# EAGLE design Atmega328p_sismin_attempt 4 (EAGLE 9.6.2)
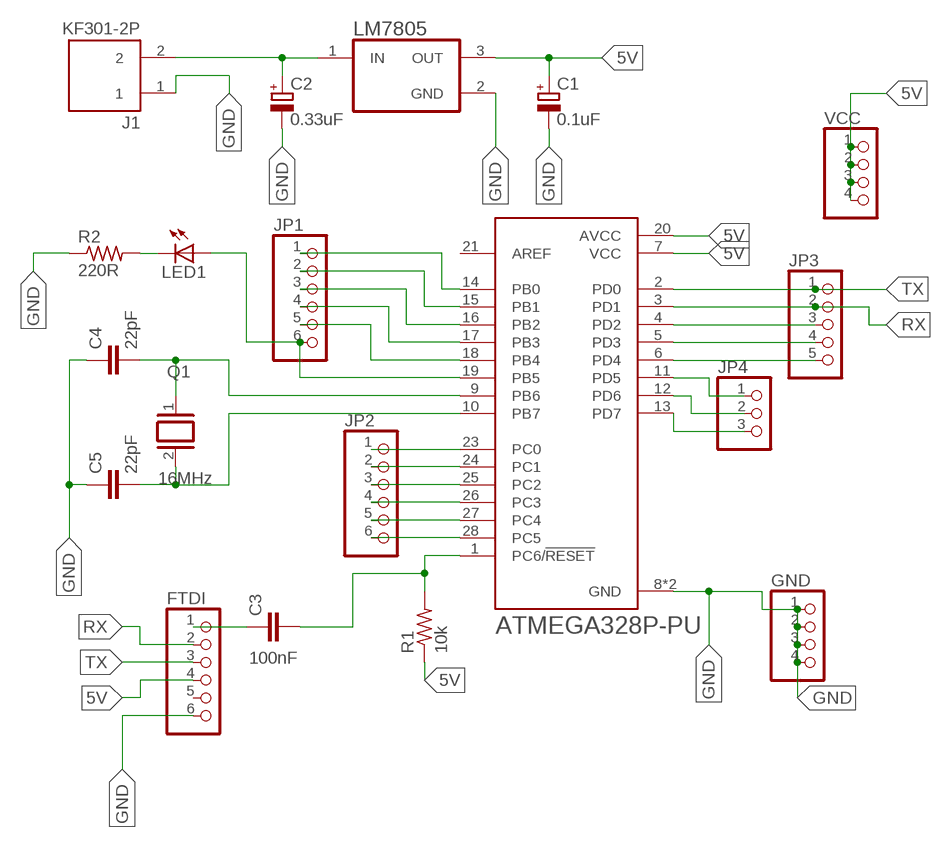
[diagram p0: schematic, sheet 1]

## Parts
C1  0.1uF  CPOL-EUE2.5-6  [E2,5-6]
C2  0.33uF  CPOL-EUE2.5-6  [E2,5-6]
C3  100nF  C-EU050-025X075  [C050-025X075]
C4  22pF  C-EU025-025X050  [C025-025X050]
C5  22pF  C-EU025-025X050  [C025-025X050]
FTDI  PINHD-1X6  [1X06]
GND  PINHD-1X4  [1X04]
J1  KF301-2P  [HANDSON_KF301-2P]
JP1  PINHD-1X6  [1X06]
JP2  PINHD-1X6  [1X06]
JP3  PINHD-1X5  [1X05]
JP4  PINHD-1X3  [1X03]
LED1  LED5MM  [LED5MM]
LM7805  LM7805CT/NOPB  [TO254P1054X470X2600-3]
Q1  16MHz  XTAL/S  [QS]
R1  10k  R-US_0207/7  [0207/7]
R2  220R  R-US_0204/7  [0204/7]
U1  ATMEGA328P-PU  [DIP794W46P254L2967H457Q28B]
VCC  PINHD-1X4  [1X04]

## Nets
5V: C1.+ FTDI.4 LM7805.3(OUT) R1.1 U1.7(VCC) U1.20(AVCC) VCC.1 VCC.2 VCC.3 VCC.4
GND: C1.- C2.- C4.1 C5.1 FTDI.6 GND.1 GND.2 GND.3 GND.4 J1.1 LM7805.2(GND) R2.1 U1.8(GND) U1.22(GND)
N$1: C4.2 Q1.1 U1.9(PB6)
N$2: C5.2 Q1.2 U1.10(PB7)
N$3: C2.+ J1.2 LM7805.1(IN)
N$4: C3.1 FTDI.1
N$5: C3.2 R1.2 U1.1(PC6/!RESET)
N$6: JP1.1 U1.14(PB0)
N$7: JP1.2 U1.15(PB1)
N$8: JP1.3 U1.16(PB2)
N$9: JP1.4 U1.17(PB3)
N$10: JP1.5 U1.18(PB4)
N$11: JP1.6 LED1.A U1.19(PB5)
N$12: LED1.K(C) R2.2
N$14: JP3.3 U1.4(PD2)
N$15: JP3.4 U1.5(PD3)
N$16: JP3.5 U1.6(PD4)
N$17: JP4.1 U1.11(PD5)
N$18: JP4.2 U1.12(PD6)
N$19: JP4.3 U1.13(PD7)
N$20: JP2.1 U1.23(PC0)
N$21: JP2.2 U1.24(PC1)
N$22: JP2.3 U1.25(PC2)
N$23: JP2.4 U1.26(PC3)
N$24: JP2.5 U1.27(PC4)
N$25: JP2.6 U1.28(PC5)
RX: FTDI.2 JP3.2 U1.3(PD1)
TX: FTDI.3 JP3.1 U1.2(PD0)
Unconnected: FTDI.5 U1.21(AREF)

## Library data of the parts
C1 C2 = rcl:CPOL-EU: POLARIZED CAPACITOR, European symbol; SPICEPREFIX: C
C3-C5 = rcl:C-EU: CAPACITOR, European symbol; SPICEPREFIX: C
FTDI JP1 JP2 = pinhead:PINHD-1X6: PIN HEADER
GND VCC = pinhead:PINHD-1X4: PIN HEADER
J1 = KF301-2P:KF301-2P: 2 Pin Terminal Block 5mm Pitch Check availability <https://pricing.snapeda.com/parts/KF301-2P/Handson%20Technology/view-part?ref=eda>; AVAILABILITY: Not in stock; DESCRIPTION: 2 Pin Terminal Block 5mm Pitch; MF: Handson Technology; MP: KF301-2P; PACKAGE: None; PRICE: None
JP3 = pinhead:PINHD-1X5: PIN HEADER
JP4 = pinhead:PINHD-1X3: PIN HEADER
LED1 = adafruit:LED: LED OSRAM: - CHIPLED LG R971, LG N971, LY N971, LG Q971, LY Q971, LO R971, LY R971 LH N974, LH R974 LS Q976, LO Q976, LY Q976 LO Q996 - Hyper CHIPLED LW Q18S LB Q993, LB Q99A, LB R99A - SideLED LS A670, LO A670, LY A670, LG A670, LP A670 LB A673, LV A673, LT A673, LW A673 LH A674 LY A675 LS A676, LA A676, LO A676, LY A676, LW A676 LS A679, LY A679, LG A679 - Hyper Micro SIDELED® LS Y876, LA Y876, LO Y876, LY Y876 LT Y87S - SmartLED LW L88C, LW L88S LB L89C, LB L89S, LG L890 LS L89K, LO L89K, LY L89K LS L896, LA L896, LO L896, LY L896 - TOPLED LS T670, LO T670, LY T670, LG T670, LP T670 LSG T670, LSP T670, LSY T670, LOP T670, LYG T670 LG T671, LOG T671, LSG T671 LB T673, LV T673, LT T673, LW T673 LH T674 LS T676, LA T676, LO T676, LY T676, LB T676, LH T676, LSB T676, LW T676 LB T67C, LV T67C, LT T67C, LS T67K, LO T67K, LY T67K, LW E67C LS E67B, LA E67B, LO E67B, LY E67B, LB E67C, LV E67C, LT E67C LW T67C LS T679, LY T679, LG T679 LS T770, LO T770, LY T770, LG T770, LP T770 LB T773, LV T773, LT T773, LW T773 LH T774 LS E675, LA E675, LY E675, LS T675 LS T776, LA T776, LO T776, LY T776, LB T776 LHGB T686 LT T68C, LB T68C - Hyper Mini TOPLED® LB M676 - Mini TOPLED Santana® LG M470 LS M47K, LO M47K, LY M47K Source: http://www.osram.convergy.de/
LM7805 = LM7805CT_NOPB:LM7805CT/NOPB: Standard Regulator Pos 5V 1A 3-Pin(3+Tab) TO-220 Rail Check availability <https://pricing.snapeda.com/parts/LM7805CT/ON%20Semiconductor/view-part?ref=eda>; AVAILABILITY: In Stock; DESCRIPTION: Linear Voltage Regulator IC Positive Fixed 1 Output 1.5A TO-220-3; MF: ON Semiconductor; MP: LM7805CT; PACKAGE: TO-220-3 ON Semiconductor; PRICE: None; PURCHASE-URL: https://pricing.snapeda.com/search/part/LM7805CT/?ref=eda
Q1 = special:XTAL/S: CRYSTAL
R1 R2 = rcl:R-US_: RESISTOR, American symbol; SPICEPREFIX: R
U1 = ATMEGA328P-PU:ATMEGA328P-PU: ATmega Series 20 MHz 32 KB Flash 2 KB SRAM 8-Bit Microcontroller - DIP-28 Check availability <https://pricing.snapeda.com/parts/ATMEGA328P-PU/Microchip/view-part?ref=eda>; AVAILABILITY: In Stock; DESCRIPTION: AVR AVR® ATmega Microcontroller IC 8-Bit 20MHz 32KB (16K x 16) FLASH 28-PDIP; MF: Microchip; MP: ATMEGA328P-PU; PACKAGE: PDIP-28 Atmel; PRICE: None; PURCHASE-URL: https://pricing.snapeda.com/search/part/ATMEGA328P-PU/?ref=eda

## Board
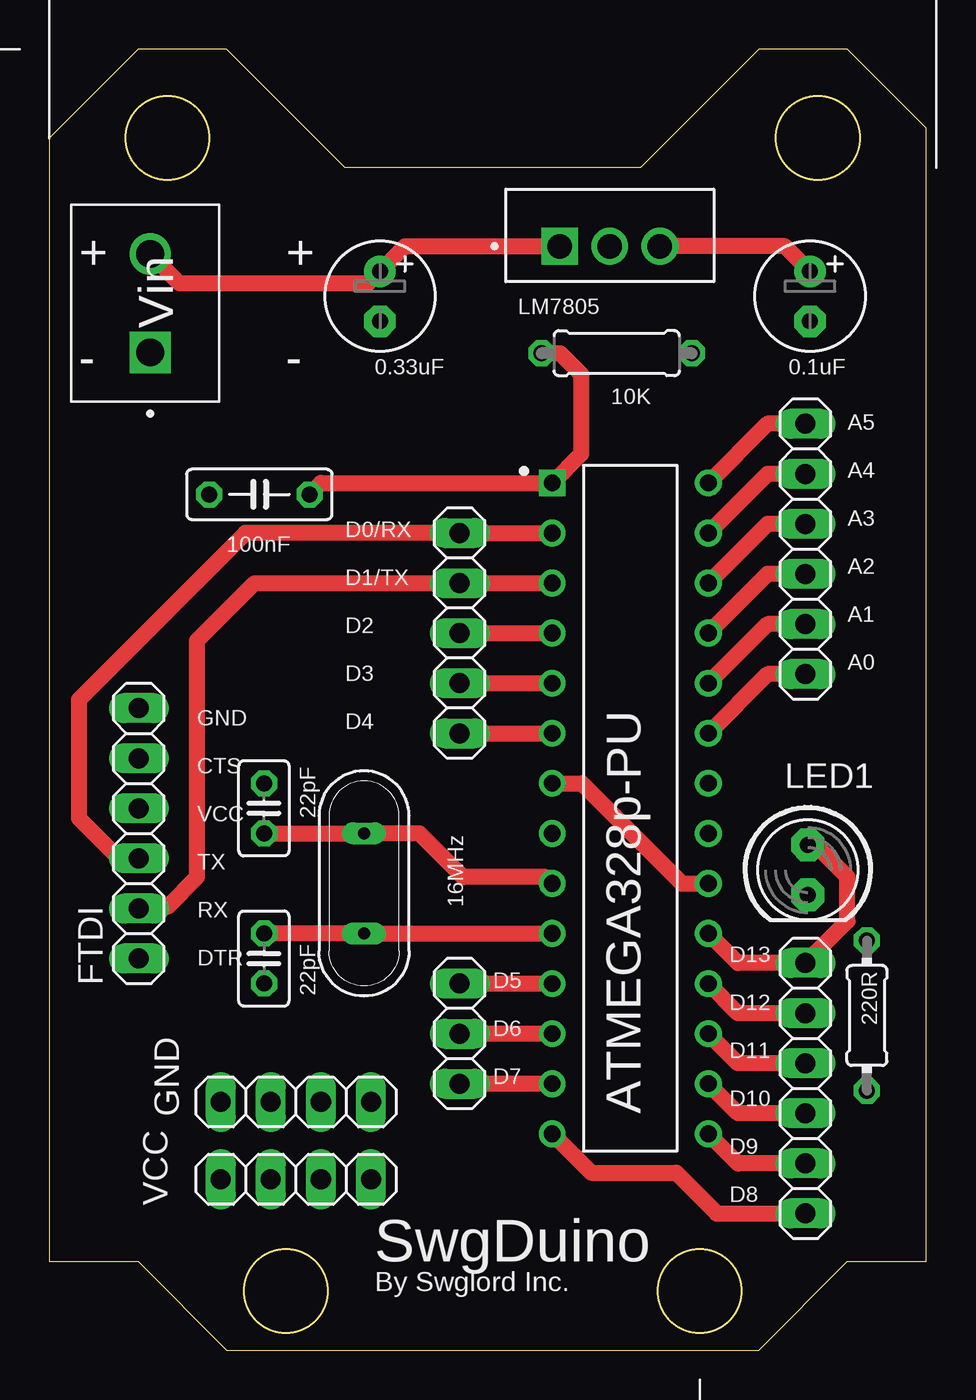
[diagram p1: board, top side]
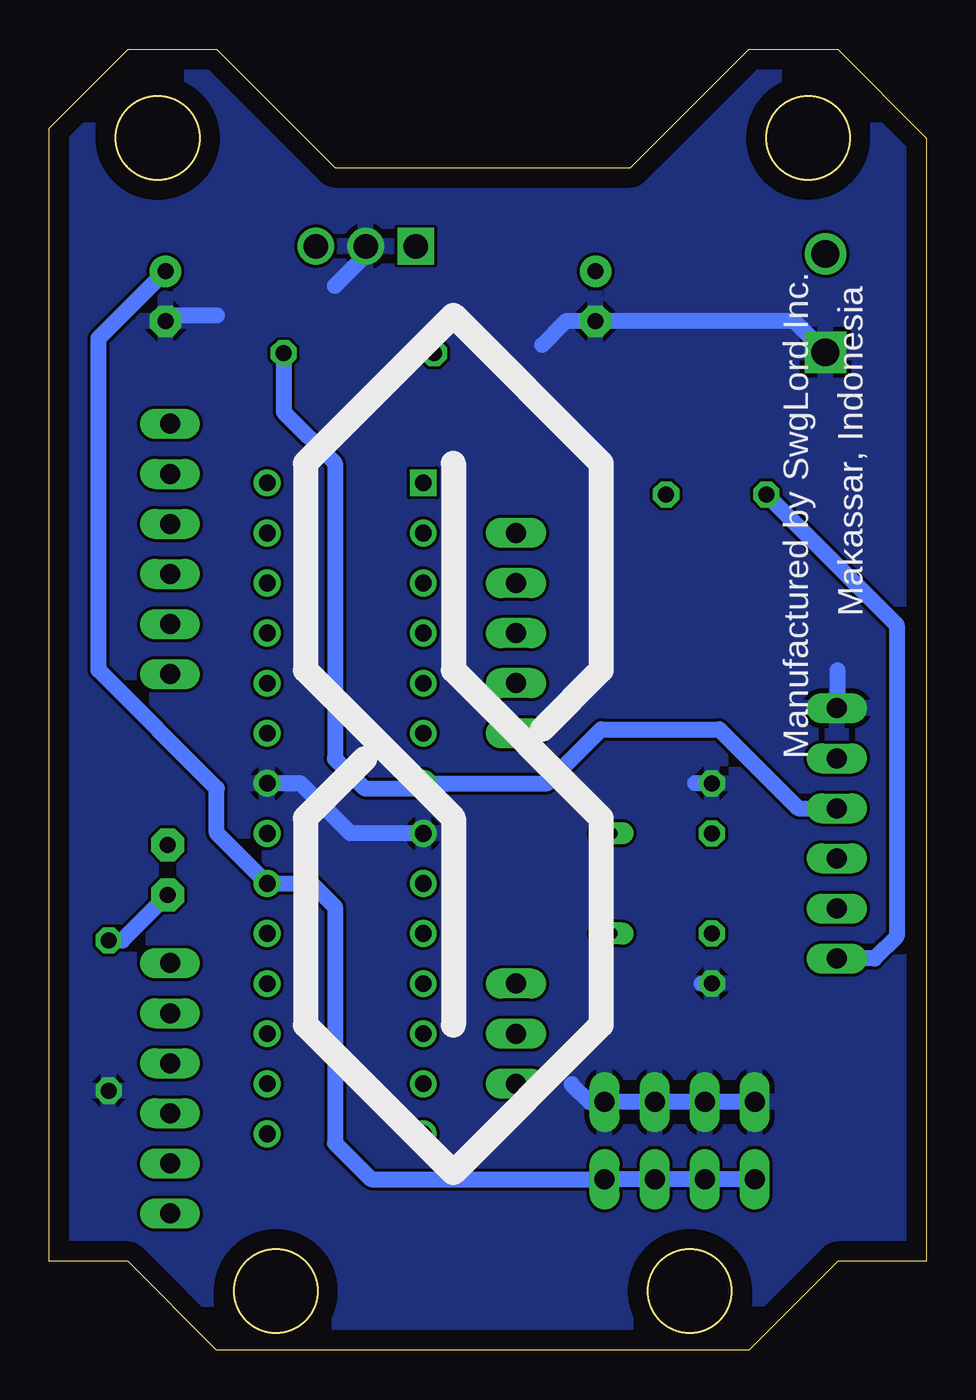
[diagram p2: board, bottom side, seen from below]

Size 44.5 x 66 mm. Coordinates in mm from the lower left corner, seen from the top.
Outline: 0,61.5 0,4.5 4.5,4.5 9,0 36,0 40.5,4.5 44.5,4.5 44.5,62 40.5,66 36,66 30,60 15,60 9,66 4.5,66 0,61.5
Outline: circle at 39,61.5 radius 2.12
Outline: circle at 33,3 radius 2.12
Outline: circle at 12,3 radius 2.12
Outline: circle at 6,61.5 radius 2.12
Copper layers (1*16): Top 0.035mm / dielectric 1.5mm / Bottom 0.035mm
Design rules "default": minimum track width 6mil, minimum drill 0.35mm, track to track 6mil, track to pad 6mil, pad to pad 6mil, via to via 6mil, smd to smd 6mil, copper to edge 40mil, drill to drill 6mil, minimum pad ring 10mil, minimum via ring 8mil, stop-mask expansion 4mil, vias tented up to drill 0mil, thermal gap 10mil

### Footprints (pad centres in the part's own frame; a part is rotated, then mirrored left to right if it is on the bottom)
E2,5-6 = drill 0.813 pad 1.6: + -1.27,0 | drill 0.813 pad 1.6 octagon: - 1.27,0
C050-025X075 = drill 0.813 octagon: 1 -2.54,0; 2 2.54,0
C025-025X050 = drill 0.813 octagon: 1 -1.27,0; 2 1.27,0
1X06 = drill 1.016 long: 1 -6.35,0; 2 -3.81,0; 3 -1.27,0; 4 1.27,0; 5 3.81,0; 6 6.35,0
1X04 = drill 1.016 long: 1 -3.81,0; 2 -1.27,0; 3 1.27,0; 4 3.81,0
HANDSON_KF301-2P = drill 1.4 square: 1 -2.5,0 | drill 1.4: 2 2.5,0
1X05 = drill 1.016 long: 1 -5.08,0; 2 -2.54,0; 3 0,0; 4 2.54,0; 5 5.08,0
1X03 = drill 1.016 long: 1 -2.54,0; 2 0,0; 3 2.54,0
LED5MM = drill 0.813 pad 1.676 octagon: A -1.27,0; K 1.27,0
TO254P1054X470X2600-3 = drill 1.24 square: 1 0,0 | drill 1.24: 2 2.54,0; 3 5.08,0
QS = drill 0.61 long: 1 -2.54,0; 2 2.54,0
0207/7 = drill 0.813 octagon: 1 -3.81,0; 2 3.81,0
0204/7 = drill 0.813 octagon: 1 -3.81,0; 2 3.81,0
DIP794W46P254L2967H457Q28B = drill 0.85 square: 1 -3.96,16.51 | drill 0.85: 2 -3.96,13.97; 3 -3.96,11.43; 4 -3.96,8.89; 5 -3.96,6.35; 6 -3.96,3.81; 7 -3.96,1.27; 8 -3.96,-1.27; 9 -3.96,-3.81; 10 -3.96,-6.35; 11 -3.96,-8.89; 12 -3.96,-11.43; 13 -3.96,-13.97; 14 -3.96,-16.51; 15 3.96,-16.51; 16 3.96,-13.97; 17 3.96,-11.43; 18 3.96,-8.89; 19 3.96,-6.35; 20 3.96,-3.81; 21 3.96,-1.27; 22 3.96,1.27; 23 3.96,3.81; 24 3.96,6.35; 25 3.96,8.89; 26 3.96,11.43; 27 3.96,13.97; 28 3.96,16.51

### Placement (x,y rotation side)
C1  38.6,53.47 270 top
C2  16.78,53.47 270 top
C3  10.66,43.42 0 top
C4  10.89,27.49 270 top
C5  10.89,19.87 90 top
FTDI  4.54,26.22 90 top
GND  12.51,12.59 0 top
J1  5.12,53.12 90 top
JP1  38.37,13.29 90 top
JP2  38.37,40.65 90 top
JP3  20.82,36.38 270 top
JP4  20.82,16.06 270 top
LED1  38.49,24.37 270 top
LM7805  25.9,56.01 0 top
Q1  15.97,23.68 270 top
R1  28.79,50.58 180 top
R2  41.49,16.98 90 top
U1  29.48,27.49 0 top
VCC  12.51,8.67 0 top

### Tracks (layer width: path | path; a pad name or v marks a point on that pad's centre or on a via)
5V
  Top 0.813: C1.+ 37.33,56.01 LM7805.3 | U1.7 27.02,28.76 32.1,23.68 U1.20
  Bottom 0.813: VCC.1 VCC.2 VCC.3 VCC.4 28.17,8.67 30,10.5 30,22.5 31.18,23.68 U1.20 36,26.24 36,28.5 42,34.5 42,51.34 C1.+ | R1.1 32.6,47.6 30,45 30,30 28.5,28.5 25.78,28.5 U1.7 19.24,28.76 16.5,31.5 10.5,31.5 6.49,27.49 FTDI.4
GND
  Bottom 0.813: J1.1 6.7,52.2 C2.- 18.3,52.2 19.5,51 | 30,54 28.44,55.56 LM7805.2 | C1.- 38.3,52.5 36,52.5 | FTDI.6 4.5,32.61 4.5,34.5 | C4.1 11.74,28.76 | C5.1 11.4,18.6 | 18,13.5 17.09,12.59 GND.4 GND.3 GND.2 GND.1 8.41,12.59 | U1.8 29.22,26.22 31.76,28.76 U1.22
  pour Bottom: -3,61.5 4.5,69 42,69 49.5,61.5 49.5,3 43.5,-3 4.5,-3 -3,4.5
N$1
  Top 0.813: U1.9 25.2,24 21,24 18.78,26.22 Q1.1 C4.2
N$2
  Top 0.813: U1.10 Q1.2 C5.2
N$3
  Top 0.813: J1.2 6.62,54.12 16.16,54.12 C2.+ 18.05,56.01 LM7805.1
N$4
  Bottom 0.813: C3.1 1.5,36.8 1.5,21 2.63,19.87 FTDI.1
N$5
  Top 0.813: C3.2 13.78,44 U1.1 27,45.48 27,49.5 25.92,50.58 R1.2
N$6
  Top 0.813: U1.14 27.5,9 31.81,9 33.87,6.94 JP1.1
N$7
  Top 0.813: U1.15 34.94,9.48 JP1.2
N$8
  Top 0.813: JP1.3 34.94,12.02 U1.16
N$9
  Top 0.813: JP1.4 34.94,14.56 U1.17
N$10
  Top 0.813: JP1.5 34.94,17.1 U1.18
N$11
  Top 0.813: U1.19 34.94,19.64 JP1.6 40.5,21.77 40.5,24 38.86,25.64 LED1.A
N$12
  Bottom 0.813: LED1.K 40.8,20.79 R2.2
N$14
  Top 0.813: JP3.3 U1.4
N$15
  Top 0.813: JP3.4 U1.5
N$16
  Top 0.813: JP3.5 U1.6
N$17
  Top 0.813: JP4.1 U1.11
N$18
  Top 0.813: U1.12 JP4.2
N$19
  Top 0.813: U1.13 JP4.3
N$20
  Top 0.813: JP2.1 36.44,34.3 U1.23
N$21
  Top 0.813: JP2.2 36.44,36.84 U1.24
N$22
  Top 0.813: JP2.3 36.44,39.38 U1.25
N$23
  Top 0.813: JP2.4 36.44,41.92 U1.26
N$24
  Top 0.813: JP2.5 36.44,44.46 U1.27
N$25
  Top 0.813: JP2.6 36.44,47 U1.28
RX
  Top 0.813: U1.3 JP3.2 10.42,38.92 7.5,36 7.5,24 6,22.5 4.63,22.5 FTDI.2
TX
  Top 0.813: U1.2 JP3.1 9.96,41.46 1.5,33 1.5,27 3.55,24.95 FTDI.3

### Text on the board
tPlace: Vin | + / / - | + / / - | 0.33uF | 0.1uF | 10K | 100nF | A5 / / A4 / / A3 / / A2 / / A1 / / A0 | D0/RX / / D1/TX / / D2 / / D3 / / D4 | 22pF | 16MHz | GND / / CTS / / VCC / / TX / / RX / / DTR | 22pF | 220R | D5 / / D6 / / D7 | ATMEGA328p-PU | D13 / / D12 / / D11 / / D10 / / D9 / / D8 | SwgDuino | By Swglord Inc.
bPlace: Makassar, Indonesia | Manufactured by SwgLord Inc.